# EAGLE design Mainboard (EAGLE 7.1.0)
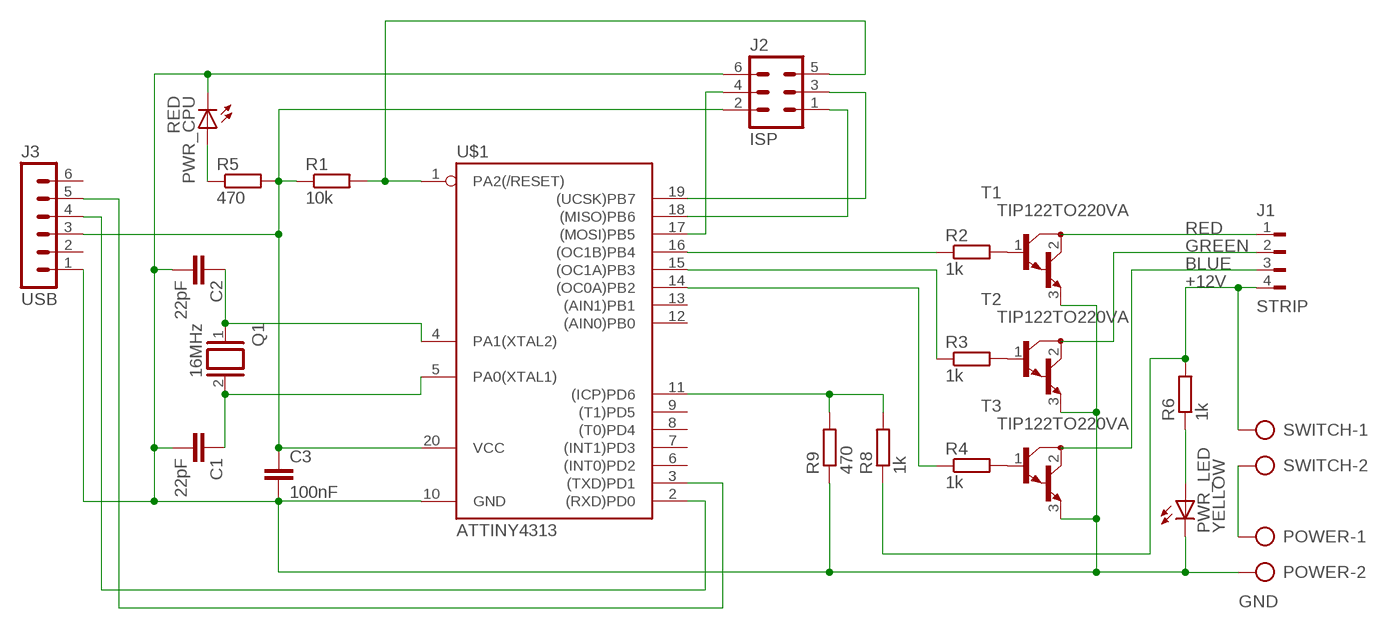
[diagram p0: schematic, sheet 1]

## Parts
C1  22pF  C-EU025-024X044  [C025-024X044]
C2  22pF  C-EU025-024X044  [C025-024X044]
C3  100nF  C-EU025-024X044  [C025-024X044]
J1  STRIP  FLOP-4W  [FLOP-4V]
J2  ISP  ML6  [ML6]
J3  USB  MA06-1  [MA06-1]
POWER  AK500/2  [AK500/2]
PWR_CPU  RED  LEDSQR2X5  [LED2X5]
PWR_LED  YELLOW  LEDSQR2X5  [LED2X5]
Q1  16MHz  XTAL/S  [QS]
R1  10k  R-EU_0204/7  [0204/7]
R2  1k  R-EU_0204/7  [0204/7]
R3  1k  R-EU_0204/7  [0204/7]
R4  1k  R-EU_0204/7  [0204/7]
R5  470  R-EU_0204/7  [0204/7]
R6  1k  R-EU_0204/7  [0204/7]
R8  1k  R-EU_0204/7  [0204/7]
R9  470  R-EU_0204/7  [0204/7]
SWITCH  AK500/2  [AK500/2]
T1  TIP122TO220VA  [TO220AV]
T2  TIP122TO220VA  [TO220AV]
T3  TIP122TO220VA  [TO220AV]
U$1  ATTINY4313  TINY2313-*P*  [DIL20]

## Nets
+5V: C3.1 J2.2 J3.3 R1.1 R5.2 U$1.20(VCC)
+12V [power]: J1.4 R6.2 R8.1 SWITCH.1
BLUE: J1.3 T3.2(C)
BLUE_PWM: R4.1 U$1.14((OC0A)PB2)
GND: C1.2 C2.2 C3.2 J2.6 J3.1 POWER.2 PWR_CPU.K(C) PWR_LED.K(C) R9.1 T1.3(E) T2.3(E) T3.3(E) U$1.10(GND)
GREEN: J1.2 T2.2(C)
GREEN_PWM: R3.1 U$1.15((OC1A)PB3)
MISO: J2.1 U$1.18((MISO)PB6)
N$1: J3.4 U$1.2((RXD)PD0)
N$2: J3.5 U$1.3((TXD)PD1)
N$3: PWR_CPU.A R5.1
N$4: R2.2 T1.1(B)
N$5: R3.2 T2.1(B)
N$6: R4.2 T3.1(B)
N$7: POWER.1 SWITCH.2
N$8: J2.4 U$1.17((MOSI)PB5)
N$13: PWR_LED.A R6.1
RED: J1.1 T1.2(C)
RED_PWM: R2.1 U$1.16((OC1B)PB4)
RESET: J2.5 R1.2 U$1.1(PA2(/RESET))
SCK: J2.3 U$1.19((UCSK)PB7)
SENSE12V: R8.2 R9.2 U$1.11((ICP)PD6)
XTAL1: C1.1 Q1.2 U$1.5(PA0(XTAL1))
XTAL2: C2.1 Q1.1 U$1.4(PA1(XTAL2))
Unconnected: J3.2 J3.6 U$1.6((INT0)PD2) U$1.7((INT1)PD3) U$1.8((T0)PD4) U$1.9((T1)PD5) U$1.12((AIN0)PB0) U$1.13((AIN1)PB1)

## Library data of the parts
C1-C3 = rcl:C-EU: CAPACITOR, European symbol
J1 = con-amp:FLOP-4W: MATE N-LOCK Floppy / HDD conector Distributor: Bürklin 71F972
J2 = con-ml:ML6: HARTING; OC_FARNELL: unknown; OC_NEWARK: unknown
J3 = con-lstb:MA06-1: PIN HEADER; OC_FARNELL: unknown; OC_NEWARK: unknown
POWER SWITCH = con-ptr500:AK500/2: CONNECTOR; OC_FARNELL: unknown; OC_NEWARK: unknown
PWR_CPU PWR_LED = led:LED: LED OSRAM: - CHIPLED LG R971, LG N971, LY N971, LG Q971, LY Q971, LO R971, LY R971 LH N974, LH R974 LS Q976, LO Q976, LY Q976 LO Q996 - Hyper CHIPLED LW Q18S LB Q993, LB Q99A, LB R99A - SideLED LS A670, LO A670, LY A670, LG A670, LP A670 LB A673, LV A673, LT A673, LW A673 LH A674 LY A675 LS A676, LA A676, LO A676, LY A676, LW A676 LS A679, LY A679, LG A679 - Hyper Micro SIDELED® LS Y876, LA Y876, LO Y876, LY Y876 LT Y87S - SmartLED LW L88C, LW L88S LB L89C, LB L89S, LG L890 LS L89K, LO L89K, LY L89K LS L896, LA L896, LO L896, LY L896 - TOPLED LS T670, LO T670, LY T670, LG T670, LP T670 LSG T670, LSP T670, LSY T670, LOP T670, LYG T670 LG T671, LOG T671, LSG T671 LB T673, LV T673, LT T673, LW T673 LH T674 LS T676, LA T676, LO T676, LY T676, LB T676, LH T676, LSB T676, LW T676 LB T67C, LV T67C, LT T67C, LS T67K, LO T67K, LY T67K, LW E67C LS E67B, LA E67B, LO E67B, LY E67B, LB E67C, LV E67C, LT E67C LW T67C LS T679, LY T679, LG T679 LS T770, LO T770, LY T770, LG T770, LP T770 LB T773, LV T773, LT T773, LW T773 LH T774 LS E675, LA E675, LY E675, LS T675 LS T776, LA T776, LO T776, LY T776, LB T776 LHGB T686 LT T68C, LB T68C - Hyper Mini TOPLED® LB M676 - Mini TOPLED Santana® LG M470 LS M47K, LO M47K, LY M47K Source: http://www.osram.convergy.de LUXEON: - LUMILED® LXK2-PW12-R00, LXK2-PW12-S00, LXK2-PW14-U00, LXK2-PW14-V00 LXK2-PM12-R00, LXK2-PM12-S00, LXK2-PM14-U00 LXK2-PE12-Q00, LXK2-PE12-R00, LXK2-PE12-S00, LXK2-PE14-T00, LXK2-PE14-U00 LXK2-PB12-K00, LXK2-PB12-L00, LXK2-PB12-M00, LXK2-PB14-N00, LXK2-PB14-P00, LXK2-PB14-Q00 LXK2-PR12-L00, LXK2-PR12-M00, LXK2-PR14-Q00, LXK2-PR14-R00 LXK2-PD12-Q00, LXK2-PD12-R00, LXK2-PD12-S00 LXK2-PH12-R00, LXK2-PH12-S00 LXK2-PL12-P00, LXK2-PL12-Q00, LXK2-PL12-R00 Source: www.luxeon.com KINGBRIGHT: KA-3528ASYC Source: www.kingbright.com
Q1 = special:XTAL/S: CRYSTAL
R1-R6 R8 R9 = rcl:R-EU_: RESISTOR, European symbol
T1-T3 = transistors-zappes:TIP122: NPN BIPOLAR DARLINGTON TRANSISTOR
U$1 = avr-7:TINY2313*: Atmel Tiny2313 2K Flash, 128 bytes EEPROM, 128 bytes RAM

## Net classes
1 power: width 0.127 mm, clearance 0.051 mm

## Board
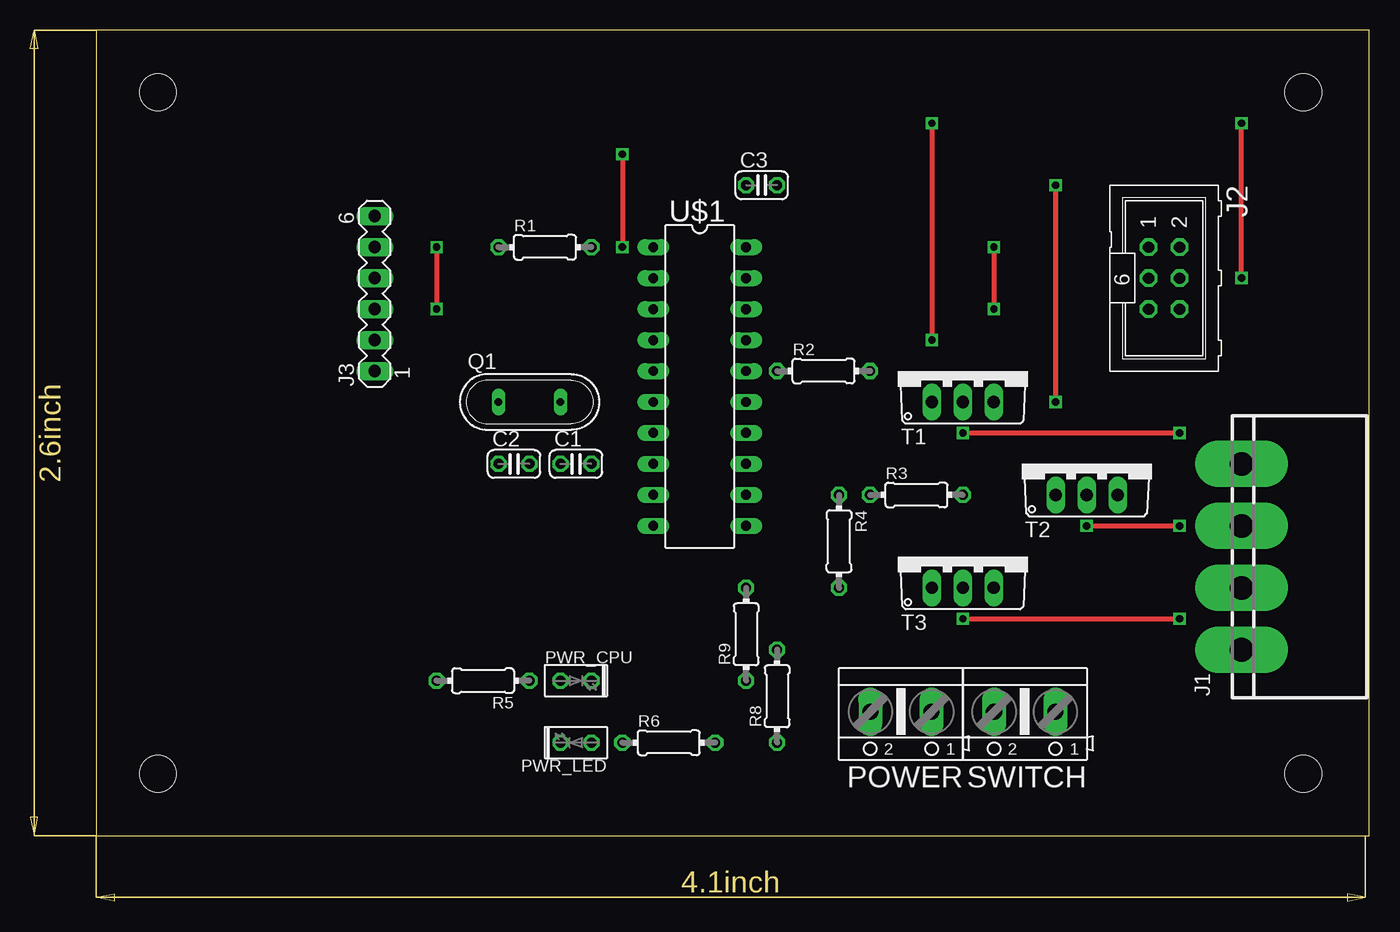
[diagram p1: board, top side]
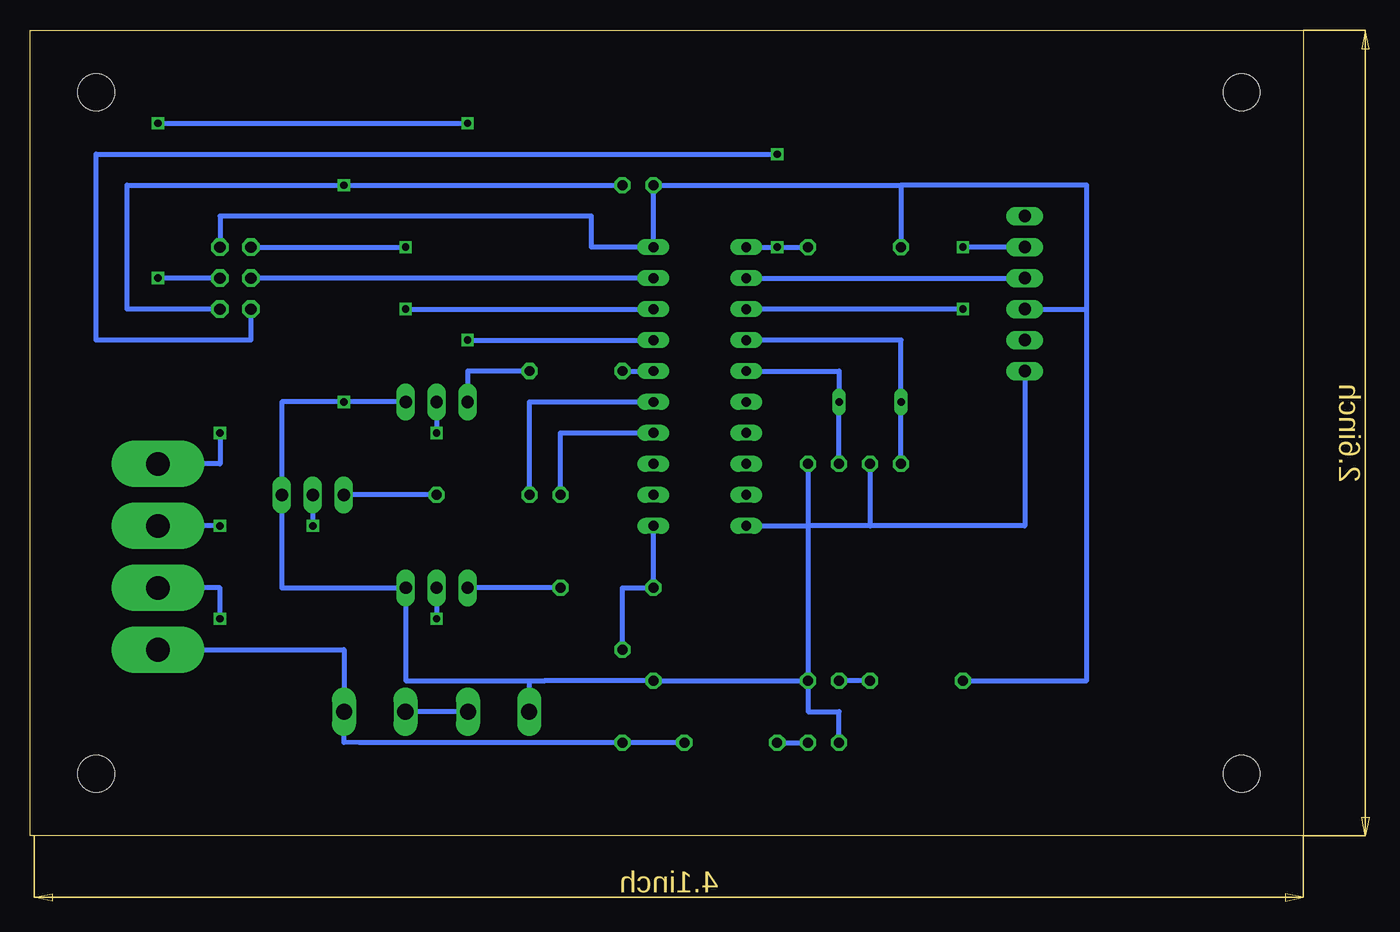
[diagram p2: board, bottom side, seen from below]

Size 104.44 x 66.03 mm. Coordinates in mm from the lower left corner, seen from the top.
Outline: 0,0 104.44,0 104.44,66.03 0,66.03 0,0
Copper layers (1*16): Top 0.035mm / dielectric 1.5mm / Bottom 0.035mm
Design rules "default": minimum track width 10mil, minimum drill 24mil, track to track 8mil, track to pad 8mil, pad to pad 8mil, via to via 8mil, smd to smd 8mil, copper to edge 40mil, drill to drill 8mil, minimum pad ring 10mil, minimum via ring 8mil, stop-mask expansion 4mil, vias tented up to drill 0mil, thermal gap 10mil
Holes 3 mm at 5.08,5.08 5.08,60.96 99.06,60.96 99.06,5.08

### Footprints (pad centres in the part's own frame; a part is rotated, then mirrored left to right if it is on the bottom)
C025-024X044 = drill 0.813 octagon: 1 -1.27,0; 2 1.27,0
FLOP-4V = drill 1.93 pad 3.81 long: 1 7.62,0; 2 2.54,0; 3 -2.54,0; 4 -7.62,0
ML6 = drill 0.914 octagon: 1 -2.54,-1.27; 2 -2.54,1.27; 3 0,-1.27; 4 0,1.27; 5 2.54,-1.27; 6 2.54,1.27
MA06-1 = drill 1.016 long: 1 -6.35,0; 2 -3.81,0; 3 -1.27,0; 4 1.27,0; 5 3.81,0; 6 6.35,0
AK500/2 = drill 1.321 long: 1 -2.515,0; 2 2.515,0
LED2X5 = drill 0.813 octagon: A -1.27,0; K 1.27,0
QS = drill 0.61 long: 1 -2.54,0; 2 2.54,0
0204/7 = drill 0.813 octagon: 1 -3.81,0; 2 3.81,0
TO220AV = drill 1.016 long: 1 -2.54,-2.54; 2 0,-2.54; 3 2.54,-2.54
DIL20 = drill 0.813 long: 1 -11.43,-3.81; 2 -8.89,-3.81; 3 -6.35,-3.81; 4 -3.81,-3.81; 5 -1.27,-3.81; 6 1.27,-3.81; 7 3.81,-3.81; 8 6.35,-3.81; 9 8.89,-3.81; 10 11.43,-3.81; 11 11.43,3.81; 12 8.89,3.81; 13 6.35,3.81; 14 3.81,3.81; 15 1.27,3.81; 16 -1.27,3.81; 17 -3.81,3.81; 18 -6.35,3.81; 19 -8.89,3.81; 20 -11.43,3.81

### Placement (x,y rotation side)
C1  39.37,30.48 0 top
C2  34.29,30.48 0 top
C3  54.61,53.34 0 top
J1  93.98,22.86 90 top
J2  87.63,45.72 270 top
J3  22.86,44.45 90 top
POWER  66.04,10.16 180 top
PWR_CPU  39.37,12.7 0 top
PWR_LED  39.37,7.62 180 top
Q1  35.56,35.56 0 top
R1  36.83,48.26 0 top
R2  59.69,38.1 0 top
R3  67.31,27.94 0 top
R4  60.96,24.13 270 top
R5  220  [0204/7]  31.75,12.7 180 top
R6  510  [0204/7]  46.99,7.62 0 top
R8  55.88,11.43 90 top
R9  53.34,16.51 90 top
SWITCH  76.2,10.16 180 top
T1  71.12,38.1 0 top
T2  81.28,30.48 0 top
T3  71.12,22.86 0 top
U$1  49.53,36.83 270 top

### Tracks (layer width: path | path; a pad name or v marks a point on that pad's centre or on a via)
+5V
  Bottom 0.406: 33.02,53.34 C3.1 U$1.20 58.42,48.26 58.42,50.8 88.9,50.8 J2.2 | J3.3 17.78,43.18 | 17.78,43.18 17.78,53.34 33.02,53.34 | 33.02,53.34 R1.1 | R5.2 17.78,12.7 17.78,43.18
+12V
  Bottom 0.406: J1.4 78.72,15.24 SWITCH.1 78.72,7.65 77.47,7.62 R6.2 R8.1
BLUE  (via drill 0.6)
  Top 0.406: v71.12,17.78 v88.9,17.78
  Bottom 0.406: T3.2 v71.12,17.78 | v88.9,17.78 88.9,20.32 J1.3
BLUE_PWM
  Bottom 0.406: R4.1 60.96,33.02 U$1.14
GND  (via drill 0.6)
  Top 0.406: v78.74,35.56 v78.74,53.34
  Bottom 0.406: C3.2 v78.74,53.34 96.52,53.34 96.52,43.18 J2.6 | PWR_LED.K 38.1,10.16 40.64,10.16 PWR_CPU.K | 62.23,12.7 73.66,12.7 T3.3 83.82,20.32 T2.3 83.82,35.56 T1.3 v78.74,35.56 | 62.23,12.7 63.52,12.68 POWER.2 | 62.23,12.7 R9.1 PWR_CPU.K | C1.2 40.64,25.4 | 40.64,25.4 PWR_CPU.K | C2.2 35.56,25.4 | 35.56,25.4 40.64,25.4 | U$1.10 40.64,25.4 | J3.1 22.86,25.4 35.56,25.4
GREEN  (via drill 0.6)
  Top 0.406: v81.28,25.4 v88.9,25.4
  Bottom 0.406: T2.2 v81.28,25.4 | v88.9,25.4 J1.2
GREEN_PWM
  Bottom 0.406: R3.1 63.5,35.56 U$1.15
MISO  (via drill 0.6)
  Top 0.406: v73.66,48.26 v73.66,43.18
  Bottom 0.406: J2.1 v73.66,48.26 | v73.66,43.18 U$1.18
N$1
  Bottom 0.406: U$1.2 J3.4
N$2  (via drill 0.6)
  Top 0.406: v27.94,48.26 v27.94,43.18
  Bottom 0.406: J3.5 v27.94,48.26 | v27.94,43.18 U$1.3
N$3
  Bottom 0.406: R5.1 PWR_CPU.A
N$4
  Bottom 0.406: R2.2 68.58,38.1 T1.1
N$5
  Bottom 0.406: R3.2 T2.1
N$6
  Bottom 0.406: R4.2 T3.1
N$7
  Bottom 0.406: POWER.1 SWITCH.2
N$8  (via drill 0.6)
  Top 0.406: v93.98,45.72 v93.98,58.42 | v68.58,58.42 v68.58,40.64
  Bottom 0.406: J2.4 v93.98,45.72 | v93.98,58.42 v68.58,58.42 | v68.58,40.64 U$1.17
N$13
  Bottom 0.406: R6.1 PWR_LED.A
RED  (via drill 0.6)
  Top 0.406: v71.12,33.02 v88.9,33.02
  Bottom 0.406: T1.2 v71.12,33.02 | v88.9,33.02 88.9,30.48 J1.1
RED_PWM
  Bottom 0.406: R2.1 U$1.16
RESET  (via drill 0.6)
  Top 0.406: v43.18,55.88 v43.18,48.26
  Bottom 0.406: U$1.1 R1.2 v43.18,48.26 | v43.18,55.88 99.06,55.88 99.06,40.64 86.36,40.64 J2.5
SCK
  Bottom 0.406: U$1.19 J2.3
SENSE12V
  Bottom 0.406: U$1.11 R9.2 55.88,20.32 R8.2
XTAL1
  Bottom 0.406: C1.1 Q1.2 38.1,38.1 U$1.5
XTAL2
  Bottom 0.406: C2.1 Q1.1 33.02,40.64 U$1.4